# Altium schematic sheet FPGA_Bank_3.SchDoc
size A4
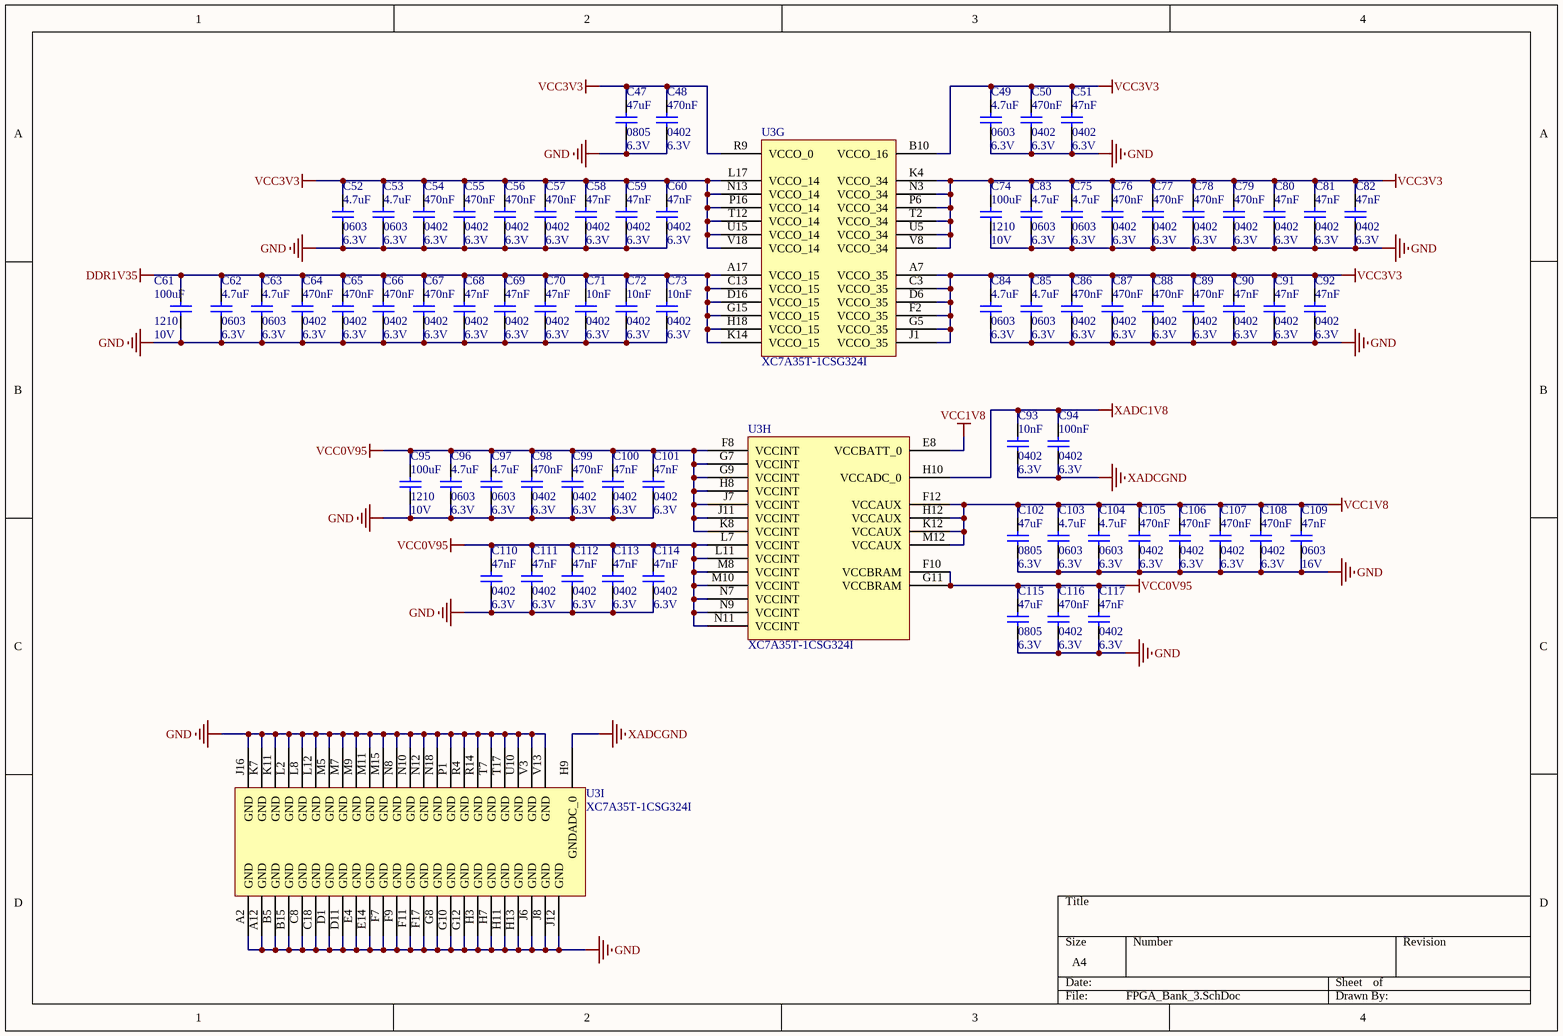
[diagram p0: FPGA_Bank_3.SchDoc]

## Parts
C47  PackageReference: 0805  V: 6.3V  [2012[0805]]  (hidden comment: 47uF)
C48  V: 6.3V  [0402]  (hidden comment: 470nF)
C49  PackageReference: 0603  V: 6.3V  [1608[0603]]  (hidden comment: 4.7uF)
C50  V: 6.3V  [0402]  (hidden comment: 470nF)
C51  V: 6.3V  [0402]  (hidden comment: 47nF)
C52  PackageReference: 0603  V: 6.3V  [1608[0603]]  (hidden comment: 4.7uF)
C53  PackageReference: 0603  V: 6.3V  [1608[0603]]  (hidden comment: 4.7uF)
C54  V: 6.3V  [0402]  (hidden comment: 470nF)
C55  V: 6.3V  [0402]  (hidden comment: 470nF)
C56  V: 6.3V  [0402]  (hidden comment: 470nF)
C57  V: 6.3V  [0402]  (hidden comment: 470nF)
C58  V: 6.3V  [0402]  (hidden comment: 47nF)
C59  V: 6.3V  [0402]  (hidden comment: 47nF)
C60  V: 6.3V  [0402]  (hidden comment: 47nF)
C61  PackageReference: 1210  V: 10V  [2012[0805]]  (hidden comment: 100uF)
C62  PackageReference: 0603  V: 6.3V  [1608[0603]]  (hidden comment: 4.7uF)
C63  PackageReference: 0603  V: 6.3V  [1608[0603]]  (hidden comment: 4.7uF)
C64  V: 6.3V  [0402]  (hidden comment: 470nF)
C65  V: 6.3V  [0402]  (hidden comment: 470nF)
C66  V: 6.3V  [0402]  (hidden comment: 470nF)
C67  V: 6.3V  [0402]  (hidden comment: 470nF)
C68  V: 6.3V  [0402]  (hidden comment: 47nF)
C69  V: 6.3V  [0402]  (hidden comment: 47nF)
C70  V: 6.3V  [0402]  (hidden comment: 47nF)
C71  V: 6.3V  [0402]  (hidden comment: 10nF)
C72  V: 6.3V  [0402]  (hidden comment: 10nF)
C73  V: 6.3V  [0402]  (hidden comment: 10nF)
C74  PackageReference: 1210  V: 10V  [2012[0805]]  (hidden comment: 100uF)
C75  PackageReference: 0603  V: 6.3V  [1608[0603]]  (hidden comment: 4.7uF)
C76  V: 6.3V  [0402]  (hidden comment: 470nF)
C77  V: 6.3V  [0402]  (hidden comment: 470nF)
C78  V: 6.3V  [0402]  (hidden comment: 470nF)
C79  V: 6.3V  [0402]  (hidden comment: 470nF)
C80  V: 6.3V  [0402]  (hidden comment: 47nF)
C81  V: 6.3V  [0402]  (hidden comment: 47nF)
C82  V: 6.3V  [0402]  (hidden comment: 47nF)
C83  PackageReference: 0603  V: 6.3V  [1608[0603]]  (hidden comment: 4.7uF)
C84  PackageReference: 0603  V: 6.3V  [1608[0603]]  (hidden comment: 4.7uF)
C85  PackageReference: 0603  V: 6.3V  [1608[0603]]  (hidden comment: 4.7uF)
C86  V: 6.3V  [0402]  (hidden comment: 470nF)
C87  V: 6.3V  [0402]  (hidden comment: 470nF)
C88  V: 6.3V  [0402]  (hidden comment: 470nF)
C89  V: 6.3V  [0402]  (hidden comment: 470nF)
C90  V: 6.3V  [0402]  (hidden comment: 47nF)
C91  V: 6.3V  [0402]  (hidden comment: 47nF)
C92  V: 6.3V  [0402]  (hidden comment: 47nF)
C93  V: 6.3V  [0402]  (hidden comment: 10nF)
C94  V: 6.3V  [0402]  (hidden comment: 100nF)
C95  PackageReference: 1210  V: 10V  [2012[0805]]  (hidden comment: 100uF)
C96  PackageReference: 0603  V: 6.3V  [1608[0603]]  (hidden comment: 4.7uF)
C97  PackageReference: 0603  V: 6.3V  [1608[0603]]  (hidden comment: 4.7uF)
C98  V: 6.3V  [0402]  (hidden comment: 470nF)
C99  V: 6.3V  [0402]  (hidden comment: 470nF)
C100  V: 6.3V  [0402]  (hidden comment: 47nF)
C101  V: 6.3V  [0402]  (hidden comment: 47nF)
C102  PackageReference: 0805  V: 6.3V  [2012[0805]]  (hidden comment: 47uF)
C103  PackageReference: 0603  V: 6.3V  [1608[0603]]  (hidden comment: 4.7uF)
C104  PackageReference: 0603  V: 6.3V  [1608[0603]]  (hidden comment: 4.7uF)
C105  V: 6.3V  [0402]  (hidden comment: 470nF)
C106  V: 6.3V  [0402]  (hidden comment: 470nF)
C107  V: 6.3V  [0402]  (hidden comment: 470nF)
C108  V: 6.3V  [0402]  (hidden comment: 470nF)
C109  PackageReference: 0603  V: 16V  [1608[0603]]  (hidden comment: 47nF)
C110  V: 6.3V  [0402]  (hidden comment: 47nF)
C111  V: 6.3V  [0402]  (hidden comment: 47nF)
C112  V: 6.3V  [0402]  (hidden comment: 47nF)
C113  V: 6.3V  [0402]  (hidden comment: 47nF)
C114  V: 6.3V  [0402]  (hidden comment: 47nF)
C115  PackageReference: 0805  V: 6.3V  [2012[0805]]  (hidden comment: 47uF)
C116  V: 6.3V  [0402]  (hidden comment: 470nF)
C117  V: 6.3V  [0402]  (hidden comment: 47nF)
U3  XC7A35T-1CSG324I  [CSG324]  (parts G,H,I of 9)

## Nets
DDR1V35: C61.1 C62.1 C63.1 C64.1 C65.1 C66.1 C67.1 C68.1 C69.1 C70.1 C71.1 C72.1 C73.1 U3.A17(VCCO_15) U3.C13(VCCO_15) U3.D16(VCCO_15) U3.G15(VCCO_15) U3.H18(VCCO_15) U3.K14(VCCO_15)
GND: C47.2 C48.2 C49.2 C50.2 C51.2 C52.2 C53.2 C54.2 C55.2 C56.2 C57.2 C58.2 C59.2 C60.2 C61.2 C62.2 C63.2 C64.2 C65.2 C66.2 C67.2 C68.2 C69.2 C70.2 C71.2 C72.2 C73.2 C74.2 C75.2 C76.2 C77.2 C78.2 C79.2 C80.2 C81.2 C82.2 C83.2 C84.2 C85.2 C86.2 C87.2 C88.2 C89.2 C90.2 C91.2 C92.2 C95.2 C96.2 C97.2 C98.2 C99.2 C100.2 C101.2 C102.2 C103.2 C104.2 C105.2 C106.2 C107.2 C108.2 C109.2 C110.2 C111.2 C112.2 C113.2 C114.2 C115.2 C116.2 C117.2 U3.A2(GND) U3.A12(GND) U3.B5(GND) U3.B15(GND) U3.C8(GND) U3.C18(GND) U3.D1(GND) U3.D11(GND) U3.E4(GND) U3.E14(GND) U3.F7(GND) U3.F9(GND) U3.F11(GND) U3.F17(GND) U3.G8(GND) U3.G10(GND) U3.G12(GND) U3.H3(GND) U3.H7(GND) U3.H11(GND) U3.H13(GND) U3.J6(GND) U3.J8(GND) U3.J12(GND) U3.J16(GND) U3.K7(GND) U3.K11(GND) U3.L2(GND) U3.L8(GND) U3.L12(GND) U3.M5(GND) U3.M7(GND) U3.M9(GND) U3.M11(GND) U3.M15(GND) U3.N8(GND) U3.N10(GND) U3.N12(GND) U3.N18(GND) U3.P1(GND) U3.R4(GND) U3.R14(GND) U3.T7(GND) U3.T17(GND) U3.U10(GND) U3.V3(GND) U3.V13(GND)
VCC0V95: C95.1 C96.1 C97.1 C98.1 C99.1 C100.1 C101.1 C110.1 C111.1 C112.1 C113.1 C114.1 C115.1 C116.1 C117.1 U3.F8(VCCINT) U3.F10(VCCBRAM) U3.G7(VCCINT) U3.G9(VCCINT) U3.G11(VCCBRAM) U3.H8(VCCINT) U3.J7(VCCINT) U3.J11(VCCINT) U3.K8(VCCINT) U3.L7(VCCINT) U3.L11(VCCINT) U3.M8(VCCINT) U3.M10(VCCINT) U3.N7(VCCINT) U3.N9(VCCINT) U3.N11(VCCINT)
VCC1V8: C102.1 C103.1 C104.1 C105.1 C106.1 C107.1 C108.1 C109.1 U3.E8(VCCBATT_0) U3.F12(VCCAUX) U3.H12(VCCAUX) U3.K12(VCCAUX) U3.M12(VCCAUX)
VCC3V3: C47.1 C48.1 C49.1 C50.1 C51.1 C52.1 C53.1 C54.1 C55.1 C56.1 C57.1 C58.1 C59.1 C60.1 C74.1 C75.1 C76.1 C77.1 C78.1 C79.1 C80.1 C81.1 C82.1 C83.1 C84.1 C85.1 C86.1 C87.1 C88.1 C89.1 C90.1 C91.1 C92.1 U3.A7(VCCO_35) U3.B10(VCCO_16) U3.C3(VCCO_35) U3.D6(VCCO_35) U3.F2(VCCO_35) U3.G5(VCCO_35) U3.J1(VCCO_35) U3.K4(VCCO_34) U3.L17(VCCO_14) U3.N3(VCCO_34) U3.N13(VCCO_14) U3.P6(VCCO_34) U3.P16(VCCO_14) U3.R9(VCCO_0) U3.T2(VCCO_34) U3.T12(VCCO_14) U3.U5(VCCO_34) U3.U15(VCCO_14) U3.V8(VCCO_34) U3.V18(VCCO_14)
XADC1V8: C93.1 C94.1 U3.H10(VCCADC_0)
XADCGND: C93.2 C94.2 U3.H9(GNDADC_0)

## Library data of the parts
C47-C117 = Cap Semi: Capacitor (Semiconductor SIM Model); LatestRevisionDate: 17-Jul-2002; LatestRevisionNote: Re-released for DXP Platform.; Publisher: Altium Limited
  C47 C102 C115: Value: 47uF
  C48 C50 C54-C57 C64-C67 C76-C79 C86-C89 C98 C99 C105-C108 C116: PackageReference: 0402; Value: 470nF
  C49 C52 C53 C62 C63 C75 C83-C85 C96 C97 C103 C104: Value: 4.7uF
  C51 C58-C60 C68-C70 C80-C82 C90-C92 C100 C101 C110-C114 C117: PackageReference: 0402; Value: 47nF
  C61 C74 C95: Value: 100uF
  C71-C73 C93: PackageReference: 0402; Value: 10nF
  C94: PackageReference: 0402; Value: 100nF
  C109: Value: 47nF
U3 = XC7A35T-1CSG324I: Artix-7 FPGA, 210 User I/Os, 0 GTP, 324-Ball BGA, Speed Grade 1, Industrial Grade, Pb-Free; Manufacturer: Xilinx; Total Block RAM: 1800 Kb; GTP: 0; Clock Mgmt Tiles (CMTs): 5; Logic Cells: 33280; Available User I/O: 210; Speed Grades: 1; DatasheetVersion: v1.15; PackageVersion: Rev. 1.11; PackageReference: CSG-324; PackageDescription: 324-Ball Wire-Bond Chip-Scale BGA, Body 15 x 15 mm, Pitch 0.8 mm; Maximum Distributed RAM: 400 Kb; Operating Temperature Range: Industrial; NexusDeviceID: XC7A35T-1CSG324I; Mounting Technology: Surface Mount; PartNumber: XC7A35T-1CSG324I; ComponentLink1Description: Manufacturer URL; ComponentLink1URL: http://www.xilinx.com/; ComponentLink2Description: Datasheet; ComponentLink2URL: http://www.xilinx.com/support/documentation/data_sheets/ds180_7Series_Overview.pdf; ComponentLink3Description: Package Specification; ComponentLink3URL: http://www.xilinx.com/support/documentation/user_guides/ug475_7Series_Pkg_Pinout.pdf; ComponentLink4Description: DC and Switching Characteristics; ComponentLink4URL: http://www.xilinx.com/support/documentation/data_sheets/ds181_Artix_7_Data_Sheet.pdf; ComponentLink5Description: Package File; ComponentLink5URL: http://www.xilinx.com/support/packagefiles/a7packages/xc7a200tsbg484pkg.txt; ComponentLink6Description: Packaging and Pinout; ComponentLink6URL: http://www.xilinx.com/support/documentation/user_guides/ug475_7Series_Pkg_Pinout.pdf